# Altium schematic sheet PuppyLight.SchDoc
size 209 x 148 mm; DocumentNumber: 1; SheetNumber: 1; SheetTotal: 1
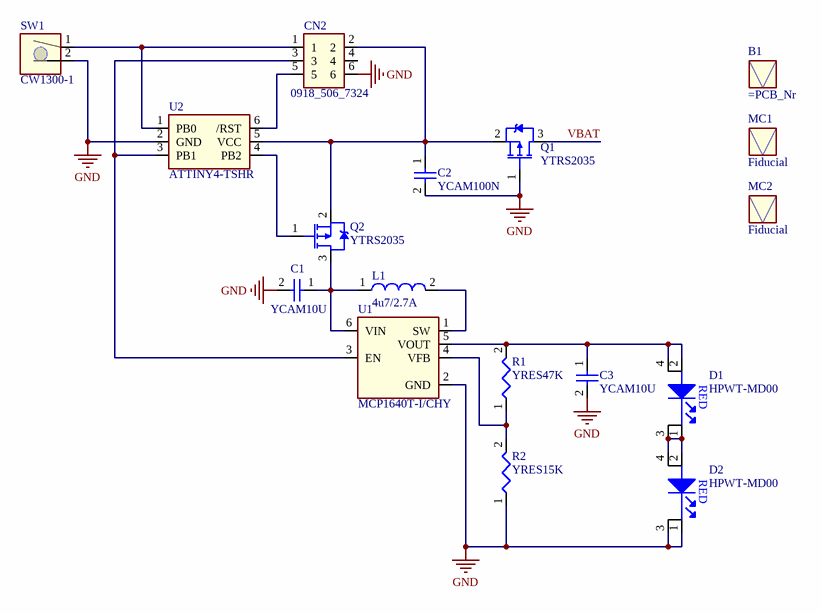
[diagram p0: PuppyLight.SchDoc]

## Parts
B1  (no value)  [MC_BoardNr]
C1  YCAM10U  [CA_1206]
C2  YCAM100N  [CA_1206]
C3  YCAM10U  [CA_1206]
CN2  0918_506_7324  [CN_HARTING_918506X324]
D1  HPWT-MD00  [DI_HPWT_Mx000-00000]
D2  HPWT-MD00  [DI_HPWT_Mx000-00000]
L1  4u7/2.7A  [CL_STD_2220]
MC1  Fiducial  [MC_FIDUCIAL]  (no BOM)
MC2  Fiducial  [MC_FIDUCIAL]  (no BOM)
Q1  YTRS2035  [SC_SOT23]
Q2  YTRS2035  [SC_SOT23]
R1  YRES47K  [RE_1206]
R2  YRES15K  [RE_1206]
SW1  CW1300-1  [SW_TILT_Comus_CW1300-1]
U1  MCP1640T-I/CHY  [SC_SOT23-6]
U2  ATTINY4-TSHR  [SC_SOT23-6]

## Nets
GND: C1.2 C2.2 C3.2 CN2.6 D2.1(C) D2.3(C) Q1.1(G) R2.1 SW1.2 U1.2(GND) U2.2(GND)
VBAT: Q1.3(D)
NetC1_1: C1.1 L1.1 Q2.3(D) U1.6(VIN)
NetC2_1: C2.1 CN2.2 Q1.2(S) Q2.2(S) U2.5(VCC)
NetC3_1: C3.1 D1.2(A) D1.4(A) R1.2 U1.5(VOUT)
NetCN2_1: CN2.1 SW1.1 U2.1(PB0)
NetCN2_3: CN2.3 U1.3(EN) U2.3(PB1)
NetCN2_5: CN2.5 U2.6(/RST)
NetD1_1: D1.1(C) D1.3(C) D2.2(A) D2.4(A)
NetL1_2: L1.2 U1.1(SW)
NetQ2_1: Q2.1(G) U2.4(PB2)
NetR1_1: R1.1 R2.2 U1.4(VFB)

Not connected (* = marked no-connect by the designer): CN2 4

## Notes on the sheet
- Title:
- Doc. Name:
- Variant:
- PCB Nr.:
- Rev.:
- Date:
- Drawn by:
- Sheet:
- of
- (in symbol HPWT-MD00) RED

## Library data of the parts
B1 = BARE_PCB: Part Number: BARE_PCB; Order Code: =PCB_Nr
C1 C3 = YCAM10U: Order Code: Farnell 1828807; Part Number: YCAM10U; Component Type: capacitor
C2 = YCAM100N: Order Code: Farnell 1759361; Part Number: YCAM100N; Component Type: capacitor
CN2 = 0918_506_7324: Manufacturer: Harting; Order Code: Farnell 1096984; Part Number: 0918_506_7324; Component Type: connector
D1 D2 = HPWT-MD00: Manufacturer: Lumileds; Order Code: Farnell 1219889; Part Number: HPWT-MD00; Component Type: led
L1 = LQH55DN4R7M03L: Manufacturer: Murata; Order Code: Farnell 1515511; Part Number: LQH55DN4R7M03L; Component Type: inductor
Q1 Q2 = YTRS2035: Manufacturer: Diodes Inc.; Order Code: Farnell 2061419; Part Number: YTRS2035; Component Type: pmos
R1 = YRES47K: Resistor; Manufacturer: Vishay Draloric; Order Code: Farnell 2074659 / 2079013; Part Number: YRES47K; Component Type: resistor
R2 = YRES15K: Resistor; Manufacturer: Welwyn; Order Code: Farnell 1100223; Part Number: YRES15K; Component Type: resistor
SW1 = CW1300-1: Manufacturer: Comus; Order Code: Farnell 540614; Part Number: CW1300-1; Component Type: switch
U1 = MCP1640T-I/CHY: Manufacturer: Microchip; Order Code: Farnell 1800205; Part Number: MCP1640T-I/CHY; Component Type: regulator
U2 = ATTINY4-TSHR: Manufacturer: Atmel; Order Code: Farnell 1841625; Part Number: ATTINY4-TSHR; Component Type: microcontroller
MC1 MC2 = Fiducial: Part Number: Fiducial